# Altium schematic sheet WR.SchDoc
size A3
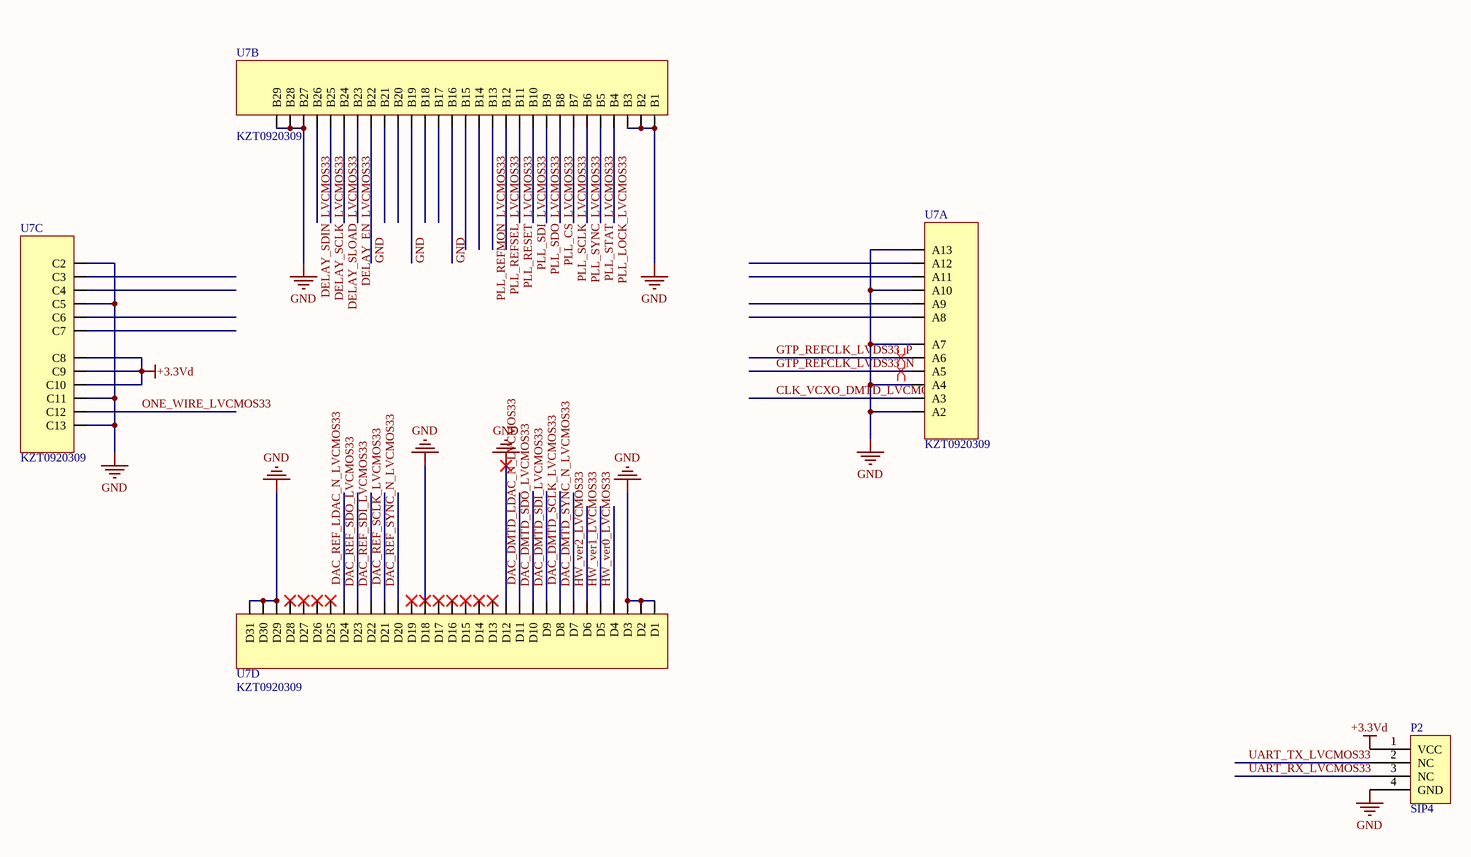
[diagram p0: WR.SchDoc]

## Parts
P2  SIP4  [HDR1X4]
U7  KZT0920309  [KZT0920309]  (parts A,B,C,D of 4)

## Nets
+3.3Vd: P2.1(VCC) U7.C8 U7.C9 U7.C10
GND: P2.4(GND) U7.A2 U7.A4 U7.A7 U7.A10 U7.A13 U7.B1 U7.B2 U7.B3 U7.B16 U7.B19 U7.B22 U7.B27 U7.B28 U7.B29 U7.C2 U7.C5 U7.C11 U7.C13 U7.D1 U7.D2 U7.D3 U7.D12 U7.D18 U7.D29 U7.D30 U7.D31
CLK_VCXO_DMTD_LVCMOS33: U7.A3
DAC_DMTD_LDAC_N_LVCMOS33: U7.D11
DAC_DMTD_SCLK_LVCMOS33: U7.D8
DAC_DMTD_SDI_LVCMOS33: U7.D9
DAC_DMTD_SDO_LVCMOS33: U7.D10
DAC_DMTD_SYNC_N_LVCMOS33: U7.D7
DAC_REF_LDAC_N_LVCMOS33: U7.D24
DAC_REF_SCLK_LVCMOS33: U7.D21
DAC_REF_SDI_LVCMOS33: U7.D22
DAC_REF_SDO_LVCMOS33: U7.D23
DAC_REF_SYNC_N_LVCMOS33: U7.D20
DELAY_EN_LVCMOS33: U7.B23
DELAY_SCLK_LVCMOS33: U7.B25
DELAY_SDIN_LVCMOS33: U7.B26
DELAY_SLOAD_LVCMOS33: U7.B24
GTP_REFCLK_LVDS33_N: U7.A5
GTP_REFCLK_LVDS33_P: U7.A6
HW_ver0_LVCMOS33: U7.D4
HW_ver1_LVCMOS33: U7.D5
HW_ver2_LVCMOS33: U7.D6
ONE_WIRE_LVCMOS33: U7.C12
PLL_CS_LVCMOS33: U7.B8
PLL_LOCK_LVCMOS33: U7.B4
PLL_REFMON_LVCMOS33: U7.B13
PLL_REFSEL_LVCMOS33: U7.B12
PLL_RESET_LVCMOS33: U7.B11
PLL_SCLK_LVCMOS33: U7.B7
PLL_SDI_LVCMOS33: U7.B10
PLL_SDO_LVCMOS33: U7.B9
PLL_STAT_LVCMOS33: U7.B5
PLL_SYNC_LVCMOS33: U7.B6
UART_RX_LVCMOS33: P2.3(NC)
UART_TX_LVCMOS33: P2.2(NC)

Not connected (* = marked no-connect by the designer): U7 A8 A9 A11 A12 B14 B15 B17 B18 B20 B21 C3 C4 C6 C7 D13* D14* D15* D16* D17* D19* D25* D26* D27* D28*

## Layout directives
differential pair: GTP_REFCLK_LVDS33_N, GTP_REFCLK_LVDS33_P

## Library data of the parts
U7 = KZT0920309: NEM&MINI Socket